# EAGLE design Quadflat-customized (EAGLE 9.0.1)

## Sheet 1 of 2

## Sheet 2 of 2
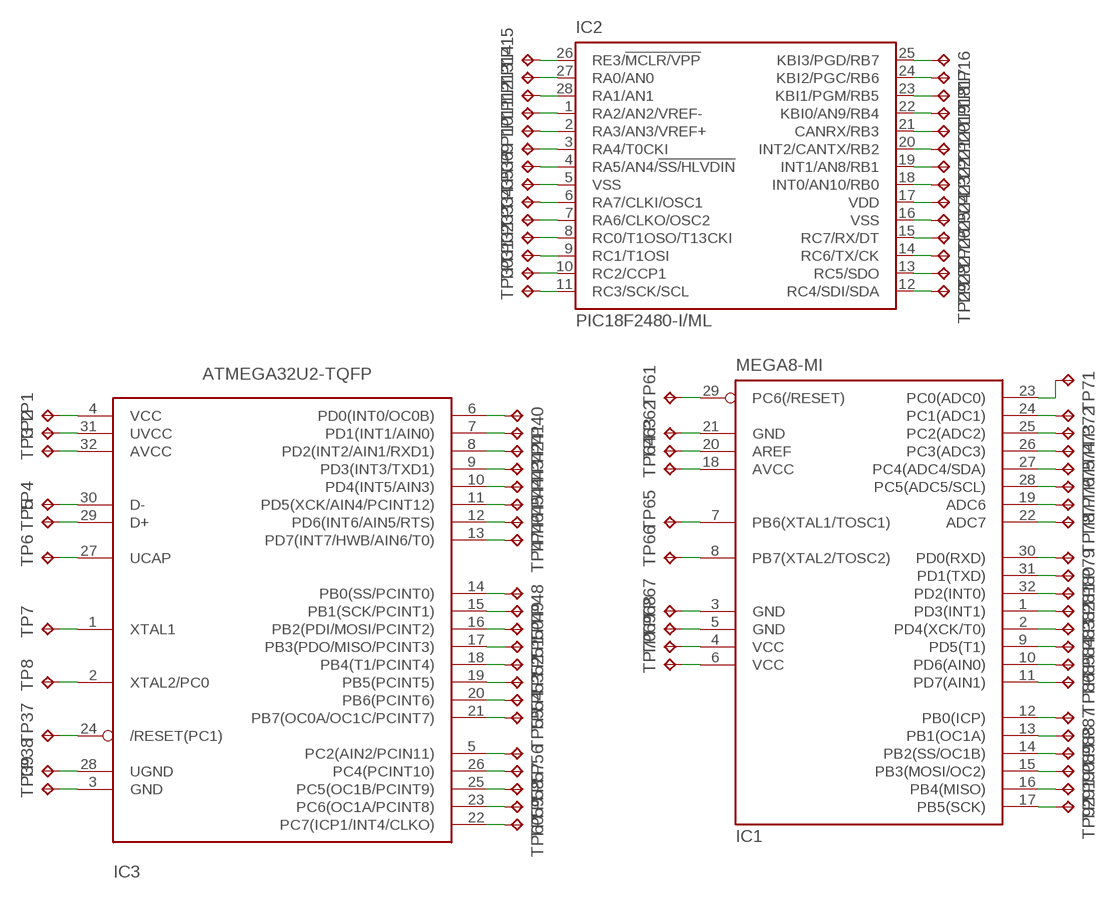
[diagram p0: schematic, sheet 2]

### Parts
IC1  MEGA8-MI  [MLF32]
IC2  PIC18F2480-I/ML  [QFN28-ML_6X6MM]
IC3  ATMEGA32U2-TQFP  [TQFP32-08]
TP1  TPPAD1-13Y  [P1-13Y]
TP2  TPPAD1-13Y  [P1-13Y]
TP3  TPPAD1-13Y  [P1-13Y]
TP4  TPPAD1-13Y  [P1-13Y]
TP5  TPPAD1-13Y  [P1-13Y]
TP6  TPPAD1-13Y  [P1-13Y]
TP7  TPPAD1-13Y  [P1-13Y]
TP8  TPPAD1-13Y  [P1-13Y]
TP9  TPPAD1-13Y  [P1-13Y]
TP10  TPPAD1-13Y  [P1-13Y]
TP11  TPPAD1-13Y  [P1-13Y]
TP12  TPPAD1-13Y  [P1-13Y]
TP13  TPPAD1-13Y  [P1-13Y]
TP14  TPPAD1-13Y  [P1-13Y]
TP15  TPPAD1-13Y  [P1-13Y]
TP16  TPPAD1-13Y  [P1-13Y]
TP17  TPPAD1-13Y  [P1-13Y]
TP18  TPPAD1-13Y  [P1-13Y]
TP19  TPPAD1-13Y  [P1-13Y]
TP20  TPPAD1-13Y  [P1-13Y]
TP21  TPPAD1-13Y  [P1-13Y]
TP22  TPPAD1-13Y  [P1-13Y]
TP23  TPPAD1-13Y  [P1-13Y]
TP24  TPPAD1-13Y  [P1-13Y]
TP25  TPPAD1-13Y  [P1-13Y]
TP26  TPPAD1-13Y  [P1-13Y]
TP27  TPPAD1-13Y  [P1-13Y]
TP28  TPPAD1-13Y  [P1-13Y]
TP29  TPPAD1-13Y  [P1-13Y]
TP30  TPPAD1-13Y  [P1-13Y]
TP31  TPPAD1-13Y  [P1-13Y]
TP32  TPPAD1-13Y  [P1-13Y]
TP33  TPPAD1-13Y  [P1-13Y]
TP34  TPPAD1-13Y  [P1-13Y]
TP35  TPPAD1-13Y  [P1-13Y]
TP36  TPPAD1-13Y  [P1-13Y]
TP37  TPPAD1-13Y  [P1-13Y]
TP38  TPPAD1-13Y  [P1-13Y]
TP39  TPPAD1-13Y  [P1-13Y]
TP40  TPPAD1-13Y  [P1-13Y]
TP41  TPPAD1-13Y  [P1-13Y]
TP42  TPPAD1-13Y  [P1-13Y]
TP43  TPPAD1-13Y  [P1-13Y]
TP44  TPPAD1-13Y  [P1-13Y]
TP45  TPPAD1-13Y  [P1-13Y]
TP46  TPPAD1-13Y  [P1-13Y]
TP47  TPPAD1-13Y  [P1-13Y]
TP48  TPPAD1-13Y  [P1-13Y]
TP49  TPPAD1-13Y  [P1-13Y]
TP50  TPPAD1-13Y  [P1-13Y]
TP51  TPPAD1-13Y  [P1-13Y]
TP52  TPPAD1-13Y  [P1-13Y]
TP53  TPPAD1-13Y  [P1-13Y]
TP54  TPPAD1-13Y  [P1-13Y]
TP55  TPPAD1-13Y  [P1-13Y]
TP56  TPPAD1-13Y  [P1-13Y]
TP57  TPPAD1-13Y  [P1-13Y]
TP58  TPPAD1-13Y  [P1-13Y]
TP59  TPPAD1-13Y  [P1-13Y]
TP60  TPPAD1-13Y  [P1-13Y]
TP61  TPPAD1-13Y  [P1-13Y]
TP62  TPPAD1-13Y  [P1-13Y]
TP63  TPPAD1-13Y  [P1-13Y]
TP64  TPPAD1-13Y  [P1-13Y]
TP65  TPPAD1-13Y  [P1-13Y]
TP66  TPPAD1-13Y  [P1-13Y]
TP67  TPPAD1-13Y  [P1-13Y]
TP68  TPPAD1-13Y  [P1-13Y]
TP69  TPPAD1-13Y  [P1-13Y]
TP70  TPPAD1-13Y  [P1-13Y]
TP71  TPPAD1-13Y  [P1-13Y]
TP72  TPPAD1-13Y  [P1-13Y]
TP73  TPPAD1-13Y  [P1-13Y]
TP74  TPPAD1-13Y  [P1-13Y]
TP75  TPPAD1-13Y  [P1-13Y]
TP76  TPPAD1-13Y  [P1-13Y]
TP77  TPPAD1-13Y  [P1-13Y]
TP78  TPPAD1-13Y  [P1-13Y]
TP79  TPPAD1-13Y  [P1-13Y]
TP80  TPPAD1-13Y  [P1-13Y]
TP81  TPPAD1-13Y  [P1-13Y]
TP82  TPPAD1-13Y  [P1-13Y]
TP83  TPPAD1-13Y  [P1-13Y]
TP84  TPPAD1-13Y  [P1-13Y]
TP85  TPPAD1-13Y  [P1-13Y]
TP86  TPPAD1-13Y  [P1-13Y]
TP87  TPPAD1-13Y  [P1-13Y]
TP88  TPPAD1-13Y  [P1-13Y]
TP89  TPPAD1-13Y  [P1-13Y]
TP90  TPPAD1-13Y  [P1-13Y]
TP91  TPPAD1-13Y  [P1-13Y]
TP92  TPPAD1-13Y  [P1-13Y]

### Nets
N$1: IC3.4(VCC) TP1.TP
N$2: IC3.31(UVCC) TP2.TP
N$3: IC3.32(AVCC) TP3.TP
N$4: IC3.30(D-) TP4.TP
N$5: IC3.29(D+) TP5.TP
N$6: IC3.27(UCAP) TP6.TP
N$7: IC3.1(XTAL1) TP7.TP
N$8: IC3.2(XTAL2/PC0) TP8.TP
N$9: IC2.11(RC3/SCK/SCL) TP30.TP
N$10: IC2.10(RC2/CCP1) TP31.TP
N$11: IC2.9(RC1/T1OSI) TP32.TP
N$12: IC2.8(RC0/T1OSO/T13CKI) TP33.TP
N$13: IC2.7(RA6/CLKO/OSC2) TP34.TP
N$14: IC2.6(RA7/CLKI/OSC1) TP35.TP
N$15: IC2.5(VSS) TP36.TP
N$16: IC2.4(RA5/AN4/!SS/HLVDIN) TP9.TP
N$17: IC2.3(RA4/T0CKI) TP10.TP
N$18: IC2.2(RA3/AN3/VREF+) TP11.TP
N$19: IC2.1(RA2/AN2/VREF-) TP12.TP
N$20: IC2.28(RA1/AN1) TP13.TP
N$21: IC2.27(RA0/AN0) TP14.TP
N$22: IC2.26(RE3/!MCLR/VPP) TP15.TP
N$23: IC2.25(KBI3/PGD/RB7) TP16.TP
N$24: IC2.24(KBI2/PGC/RB6) TP17.TP
N$25: IC2.23(KBI1/PGM/RB5) TP18.TP
N$26: IC2.22(KBI0/AN9/RB4) TP19.TP
N$27: IC2.21(CANRX/RB3) TP20.TP
N$28: IC2.20(INT2/CANTX/RB2) TP21.TP
N$29: IC2.19(INT1/AN8/RB1) TP22.TP
N$30: IC2.18(INT0/AN10/RB0) TP23.TP
N$31: IC2.17(VDD) TP24.TP
N$32: IC2.16(VSS) TP25.TP
N$33: IC2.15(RC7/RX/DT) TP26.TP
N$34: IC2.14(RC6/TX/CK) TP27.TP
N$35: IC2.13(RC5/SDO) TP28.TP
N$36: IC2.12(RC4/SDI/SDA) TP29.TP
N$37: IC3.24(/RESET(PC1)) TP37.TP
N$38: IC3.28(UGND) TP38.TP
N$39: IC3.3(GND) TP39.TP
N$40: IC3.22(PC7(ICP1/INT4/CLKO)) TP60.TP
N$41: IC3.23(PC6(OC1A/PCINT8)) TP59.TP
N$42: IC3.25(PC5(OC1B/PCINT9)) TP58.TP
N$43: IC3.26(PC4(PCINT10)) TP57.TP
N$44: IC3.5(PC2(AIN2/PCIN11)) TP56.TP
N$45: IC3.21(PB7(OC0A/OC1C/PCINT7)) TP55.TP
N$46: IC3.20(PB6(PCINT6)) TP54.TP
N$47: IC3.19(PB5(PCINT5)) TP53.TP
N$48: IC3.18(PB4(T1/PCINT4)) TP52.TP
N$49: IC3.17(PB3(PDO/MISO/PCINT3)) TP51.TP
N$50: IC3.16(PB2(PDI/MOSI/PCINT2)) TP50.TP
N$51: IC3.15(PB1(SCK/PCINT1)) TP49.TP
N$52: IC3.14(PB0(SS/PCINT0)) TP48.TP
N$53: IC3.13(PD7(INT7/HWB/AIN6/T0)) TP47.TP
N$54: IC3.12(PD6(INT6/AIN5/RTS)) TP46.TP
N$55: IC3.11(PD5(XCK/AIN4/PCINT12)) TP45.TP
N$56: IC3.10(PD4(INT5/AIN3)) TP44.TP
N$57: IC3.9(PD3(INT3/TXD1)) TP43.TP
N$58: IC3.8(PD2(INT2/AIN1/RXD1)) TP42.TP
N$59: IC3.7(PD1(INT1/AIN0)) TP41.TP
N$60: IC3.6(PD0(INT0/OC0B)) TP40.TP
N$61: IC1.29(PC6(/RESET)) TP61.TP
N$62: IC1.21(GND) TP62.TP
N$63: IC1.20(AREF) TP63.TP
N$64: IC1.18(AVCC) TP64.TP
N$65: IC1.7(PB6(XTAL1/TOSC1)) TP65.TP
N$66: IC1.8(PB7(XTAL2/TOSC2)) TP66.TP
N$67: IC1.3(GND) TP67.TP
N$68: IC1.5(GND) TP68.TP
N$69: IC1.4(VCC) TP69.TP
N$70: IC1.6(VCC) TP70.TP
N$71: IC1.23(PC0(ADC0)) TP71.TP
N$72: IC1.24(PC1(ADC1)) TP72.TP
N$73: IC1.25(PC2(ADC2)) TP73.TP
N$74: IC1.26(PC3(ADC3)) TP74.TP
N$75: IC1.27(PC4(ADC4/SDA)) TP75.TP
N$76: IC1.28(PC5(ADC5/SCL)) TP76.TP
N$77: IC1.19(ADC6) TP77.TP
N$78: IC1.22(ADC7) TP78.TP
N$79: IC1.30(PD0(RXD)) TP79.TP
N$80: IC1.31(PD1(TXD)) TP80.TP
N$81: IC1.32(PD2(INT0)) TP81.TP
N$82: IC1.1(PD3(INT1)) TP82.TP
N$83: IC1.2(PD4(XCK/T0)) TP83.TP
N$84: IC1.9(PD5(T1)) TP84.TP
N$85: IC1.10(PD6(AIN0)) TP85.TP
N$86: IC1.11(PD7(AIN1)) TP86.TP
N$87: IC1.12(PB0(ICP)) TP87.TP
N$88: IC1.13(PB1(OC1A)) TP88.TP
N$89: IC1.14(PB2(SS/OC1B)) TP89.TP
N$90: IC1.15(PB3(MOSI/OC2)) TP90.TP
N$91: IC1.16(PB4(MISO)) TP91.TP
N$92: IC1.17(PB5(SCK)) TP92.TP

## Library data of the parts
IC1 = atmel:MEGA8: MICROCONTROLLER 8 Kbytes FLASH, 1 kbytes SRAM, 512 bytes EEPROM, USART, 6-channel 10 bit ADC, 2-channel 8 bit ADC Pin compatible with Atmega48, ATMega88, ATMega168 Source: avr.lbr; MPN: ATMEGA88PA-MU; OC_FARNELL: 1715491; OC_NEWARK: 15R0272
IC2 = microchip:PIC18F2*80: 28-Pin Enhanced Flash Microcontrollers with ECAN(TM) Technology 10-Bit A/D and nanoWatt Technology Source: http://www.microchip.com .. 39637a.pdf; MF: MICROCHIP; MPN: PIC18F2480-I/ML; OC_FARNELL: 1556179; OC_NEWARK: 71J7235
IC3 = atmega_ext:ATMEGA32U2: ATmega32u2 Pin compatible with the atmega8u2, atmega16u2 and atmega32u2 8, 16 or 32 K flash, 1K RAM, 512b EEPROM 8 bit and 16 bit timer (5 PWM total) UART, SPI (no I2C!) USB with 4 endpoints, LUFA compatible 22 I/O lines, analog comparator (no ADC!) Comes with DFU bootloader burned in!
TP1-TP92 = testpad:TP: Test pad

## Board
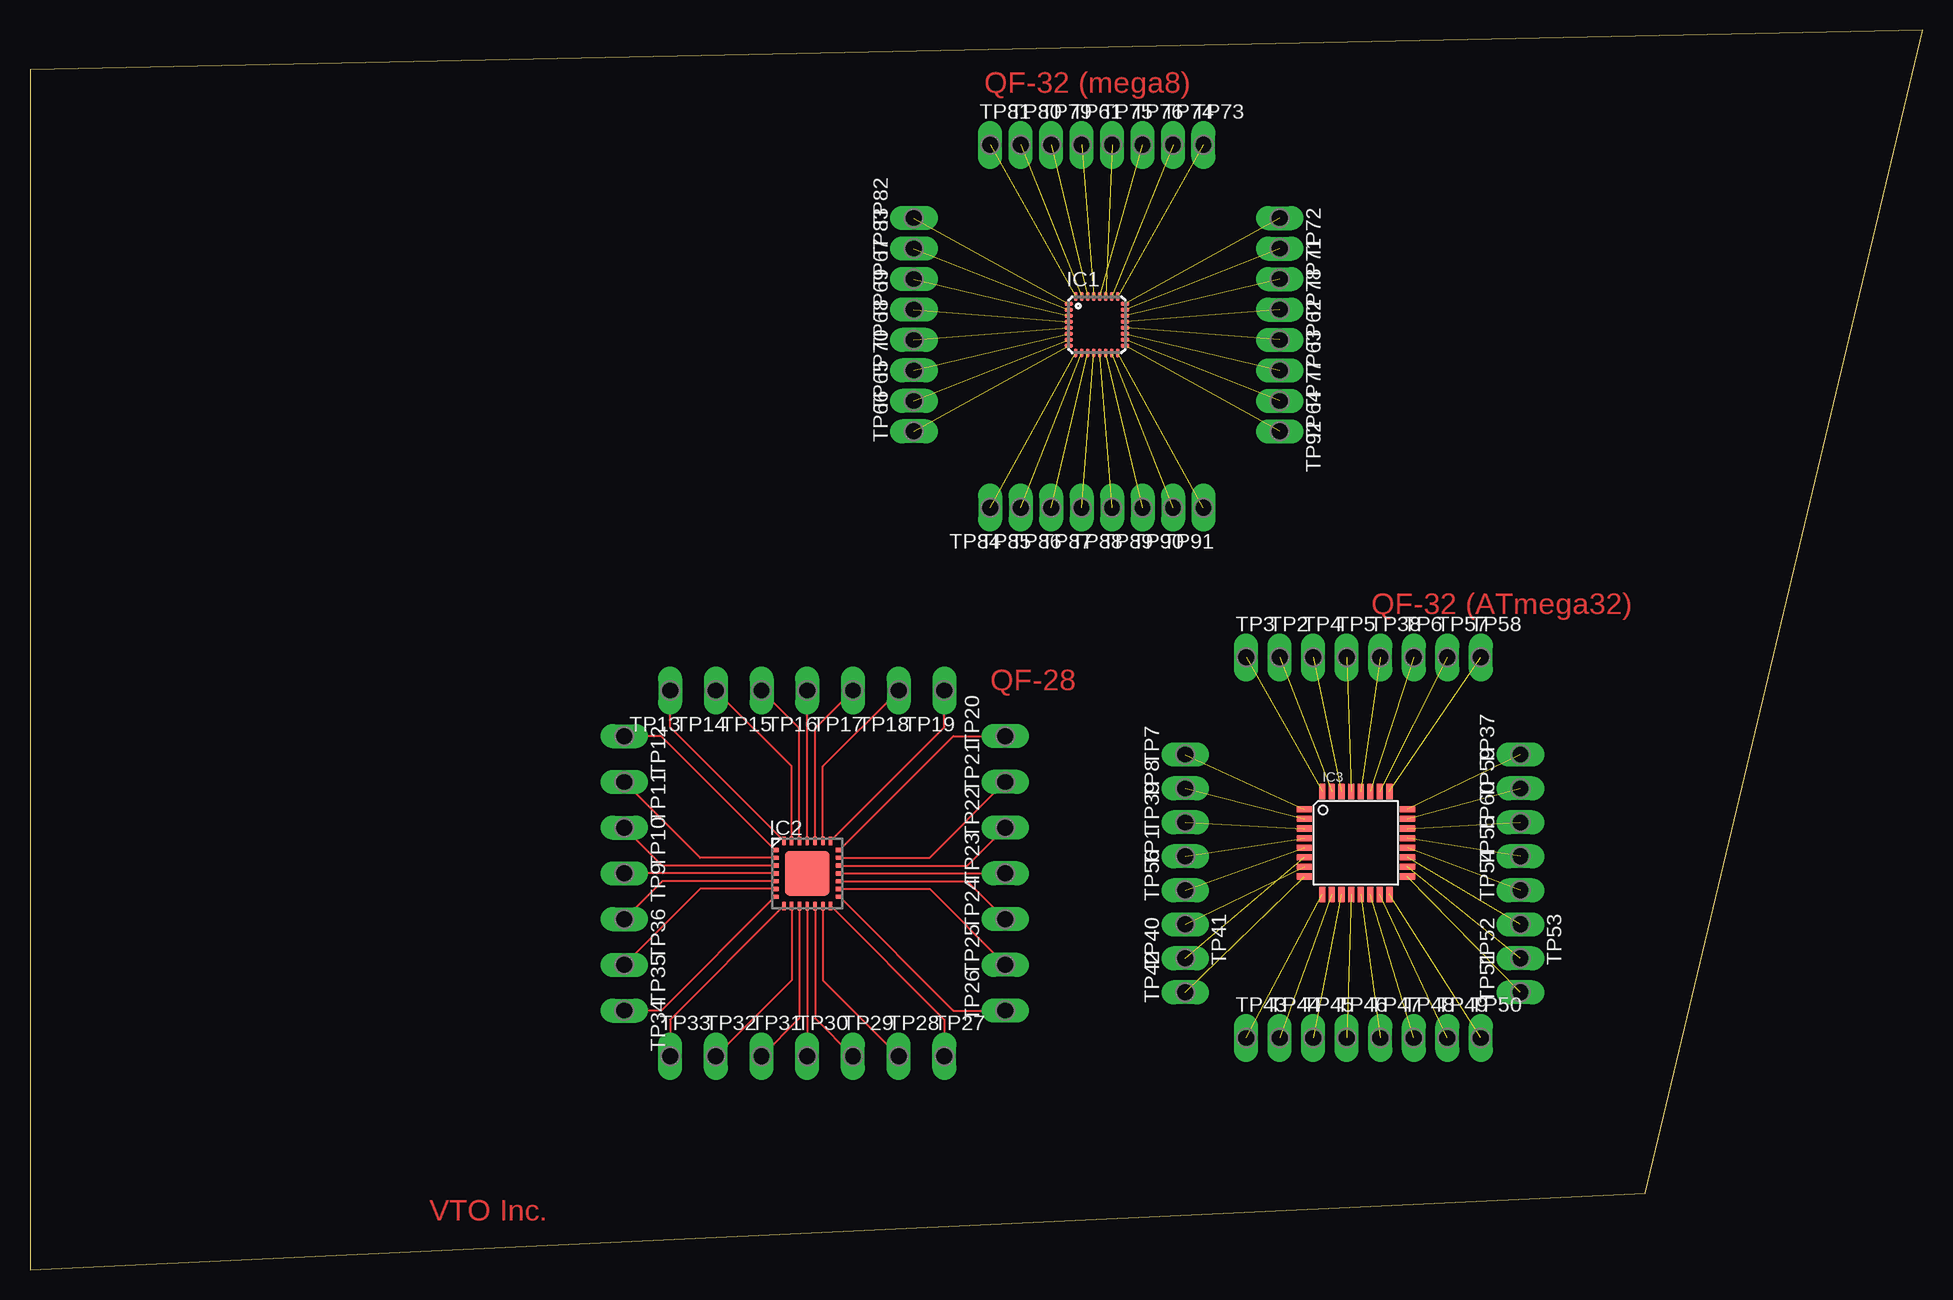
[diagram p1: board, top side]

Size 157.71 x 103.3 mm. Coordinates in mm from the lower left corner, seen from the top.
Outline: 0,0 134.6,6.35 157.71,103.3 0,100 0,0
Copper layers (1*16): Top 0.035mm / dielectric 1.5mm / Bottom 0.035mm
Design rules "default": minimum track width 6mil, minimum drill 0.35mm, track to track 6mil, track to pad 6mil, pad to pad 6mil, via to via 6mil, smd to smd 6mil, copper to edge 40mil, drill to drill 6mil, minimum pad ring 10mil, minimum via ring 8mil, stop-mask expansion 4mil, vias tented up to drill 0mil, thermal gap 10mil

### Footprints (pad centres in the part's own frame; a part is rotated, then mirrored left to right if it is on the bottom)
MLF32 = smd 0.7 x 0.3: 1 -2.35,1.75; 2 -2.35,1.25; 3 -2.35,0.75; 4 -2.35,0.25; 5 -2.35,-0.25; 6 -2.35,-0.75; 7 -2.35,-1.25; 8 -2.35,-1.75; 17 2.35,-1.75; 18 2.35,-1.25; 19 2.35,-0.75; 20 2.35,-0.25; 21 2.35,0.25; 22 2.35,0.75; 23 2.35,1.25; 24 2.35,1.75 | smd 0.3 x 0.7: 9 -1.75,-2.35; 10 -1.25,-2.35; 11 -0.75,-2.35; 12 -0.25,-2.35; 13 0.25,-2.35; 14 0.75,-2.35; 15 1.25,-2.35; 16 1.75,-2.35; 25 1.75,2.35; 26 1.25,2.35; 27 0.75,2.35; 28 0.25,2.35; 29 -0.25,2.35; 30 -0.75,2.35; 31 -1.25,2.35; 32 -1.75,2.35
QFN28-ML_6X6MM = smd 0.7 x 0.35: 1 -2.7,1.95; 2 -2.7,1.3; 3 -2.7,0.65; 4 -2.7,0; 5 -2.7,-0.65; 6 -2.7,-1.3; 7 -2.7,-1.95; 15 2.7,-1.95; 16 2.7,-1.3; 17 2.7,-0.65; 18 2.7,0; 19 2.7,0.65; 20 2.7,1.3; 21 2.7,1.95 | smd 0.35 x 0.7: 8 -1.95,-2.7; 9 -1.3,-2.7; 10 -0.65,-2.7; 11 0,-2.7; 12 0.65,-2.7; 13 1.3,-2.7; 14 1.95,-2.7; 22 1.95,2.7; 23 1.3,2.7; 24 0.65,2.7; 25 0,2.7; 26 -0.65,2.7; 27 -1.3,2.7; 28 -1.95,2.7 | smd 3.7 x 3.7: EXP 0,0
TQFP32-08 = smd 1.27 x 0.508: 1 -4.293,2.8; 2 -4.293,2; 3 -4.293,1.2; 4 -4.293,0.4; 5 -4.293,-0.4; 6 -4.293,-1.2; 7 -4.293,-2; 8 -4.293,-2.8; 17 4.293,-2.8; 18 4.293,-2; 19 4.293,-1.2; 20 4.293,-0.4; 21 4.293,0.4; 22 4.293,1.2; 23 4.293,2; 24 4.293,2.8 | smd 0.508 x 1.27: 9 -2.8,-4.293; 10 -2,-4.293; 11 -1.2,-4.293; 12 -0.4,-4.293; 13 0.4,-4.293; 14 1.2,-4.293; 15 2,-4.293; 16 2.8,-4.293; 25 2.8,4.293; 26 2,4.293; 27 1.2,4.293; 28 0.4,4.293; 29 -0.4,4.293; 30 -1.2,4.293; 31 -2,4.293; 32 -2.8,4.293
P1-13Y = drill 1.321 pad 1.905 long: TP 0,0

### Placement (x,y rotation side)
IC1  88.9,78.74 0 top
IC2  64.77,33.02 0 top
IC3  110.49,35.56 0 top
TP1  96.27,34.44 90 top
TP2  104.14,51.02 0 top
TP3  101.35,51.02 0 top
TP4  106.93,51.02 0 top
TP5  109.73,51.02 0 top
TP6  115.32,51.02 0 top
TP7  96.27,42.93 90 top
TP8  96.27,40.1 90 top
TP9  49.53,33.02 270 top
TP10  49.53,36.83 270 top
TP11  49.53,40.64 270 top
TP12  49.53,44.45 270 top
TP13  53.34,48.26 180 top
TP14  57.15,48.26 180 top
TP15  60.96,48.26 180 top
TP16  64.77,48.26 180 top
TP17  68.58,48.26 180 top
TP18  72.39,48.26 180 top
TP19  76.2,48.26 180 top
TP20  81.28,44.45 90 top
TP21  81.28,40.64 90 top
TP22  81.28,36.83 90 top
TP23  81.28,33.02 90 top
TP24  81.28,29.21 90 top
TP25  81.28,25.4 90 top
TP26  81.28,21.59 90 top
TP27  76.2,17.78 0 top
TP28  72.39,17.78 0 top
TP29  68.58,17.78 0 top
TP30  64.77,17.78 0 top
TP31  60.96,17.78 0 top
TP32  57.15,17.78 0 top
TP33  53.34,17.78 0 top
TP34  49.53,21.59 270 top
TP35  49.53,25.4 270 top
TP36  49.53,29.21 270 top
TP37  124.21,42.93 90 top
TP38  112.52,51.02 0 top
TP39  96.27,37.27 90 top
TP40  96.27,25.94 90 top
TP41  96.27,28.77 270 top
TP42  96.27,23.11 90 top
TP43  101.35,19.3 0 top
TP44  104.14,19.3 0 top
TP45  106.93,19.3 0 top
TP46  109.73,19.3 0 top
TP47  112.52,19.3 0 top
TP48  115.32,19.3 0 top
TP49  118.11,19.3 0 top
TP50  120.9,19.3 0 top
TP51  124.21,23.11 90 top
TP52  124.21,25.94 90 top
TP53  124.21,28.77 270 top
TP54  124.21,31.6 90 top
TP55  124.21,34.44 90 top
TP56  96.27,31.6 90 top
TP57  118.11,51.02 0 top
TP58  120.9,51.02 0 top
TP59  124.21,40.1 90 top
TP60  124.21,37.27 90 top
TP61  87.63,93.73 0 top
TP62  104.14,80.01 270 top
TP63  104.14,77.47 270 top
TP64  104.14,72.39 270 top
TP65  73.66,72.39 90 top
TP66  73.66,69.85 90 top
TP67  73.66,82.55 90 top
TP68  73.66,77.47 90 top
TP69  73.66,80.01 90 top
TP70  73.66,74.93 90 top
TP71  104.14,85.09 270 top
TP72  104.14,87.63 270 top
TP73  97.79,93.73 0 top
TP74  95.25,93.73 0 top
TP75  90.17,93.73 0 top
TP76  92.71,93.73 0 top
TP77  104.14,74.93 270 top
TP78  104.14,82.55 270 top
TP79  85.09,93.73 0 top
TP80  82.55,93.73 0 top
TP81  80.01,93.73 0 top
TP82  73.66,87.63 90 top
TP83  73.66,85.09 90 top
TP84  80.01,63.5 180 top
TP85  82.55,63.5 180 top
TP86  85.09,63.5 180 top
TP87  87.63,63.5 180 top
TP88  90.17,63.5 180 top
TP89  92.71,63.5 180 top
TP90  95.25,63.5 180 top
TP91  97.79,63.5 180 top
TP92  104.14,69.85 270 top

### Tracks (layer width: path | path; a pad name or v marks a point on that pad's centre or on a via)
N$1  (1 unrouted)
N$2  (1 unrouted)
N$3  (1 unrouted)
N$4  (1 unrouted)
N$5  (1 unrouted)
N$6  (1 unrouted)
N$7  (1 unrouted)
N$8  (1 unrouted)
N$9
  Top 0.152: IC2.11 TP30.TP
N$10
  Top 0.152: IC2.10 64.12,20.94 TP31.TP
N$11
  Top 0.152: IC2.9 63.47,24.1 TP32.TP
N$12
  Top 0.152: IC2.8 53.34,20.84 TP33.TP
N$13
  Top 0.152: IC2.7 52.59,21.59 TP34.TP
N$14
  Top 0.152: IC2.6 55.85,31.72 TP35.TP
N$15
  Top 0.152: IC2.5 52.69,32.37 TP36.TP
N$16
  Top 0.152: IC2.4 TP9.TP
N$17
  Top 0.152: IC2.3 52.69,33.67 TP10.TP
N$18
  Top 0.152: IC2.2 55.85,34.32 TP11.TP
N$19
  Top 0.152: IC2.1 52.59,44.45 TP12.TP
N$20
  Top 0.152: IC2.28 53.34,45.2 TP13.TP
N$21
  Top 0.152: IC2.27 63.47,41.94 TP14.TP
N$22
  Top 0.152: IC2.26 64.12,45.1 TP15.TP
N$23
  Top 0.152: IC2.25 TP16.TP
N$24
  Top 0.152: IC2.24 65.42,45.1 TP17.TP
N$25
  Top 0.152: IC2.23 66.07,41.94 TP18.TP
N$26
  Top 0.152: IC2.22 76.2,45.2 TP19.TP
N$27
  Top 0.152: IC2.21 76.95,44.45 TP20.TP
N$28
  Top 0.152: IC2.20 74.96,34.32 TP21.TP
N$29
  Top 0.152: IC2.19 78.12,33.67 TP22.TP
N$30
  Top 0.152: IC2.18 TP23.TP
N$31
  Top 0.152: IC2.17 78.12,32.37 TP24.TP
N$32
  Top 0.152: IC2.16 74.96,31.72 TP25.TP
N$33
  Top 0.152: IC2.15 76.95,21.59 TP26.TP
N$34
  Top 0.152: IC2.14 76.2,20.84 TP27.TP
N$35
  Top 0.152: IC2.13 66.07,24.1 TP28.TP
N$36
  Top 0.152: IC2.12 65.42,20.94 TP29.TP
N$37  (1 unrouted)
N$38  (1 unrouted)
N$39  (1 unrouted)
N$40  (1 unrouted)
N$41  (1 unrouted)
N$42  (1 unrouted)
N$43  (1 unrouted)
N$44  (1 unrouted)
N$45  (1 unrouted)
N$46  (1 unrouted)
N$47  (1 unrouted)
N$48  (1 unrouted)
N$49  (1 unrouted)
N$50  (1 unrouted)
N$51  (1 unrouted)
N$52  (1 unrouted)
N$53  (1 unrouted)
N$54  (1 unrouted)
N$55  (1 unrouted)
N$56  (1 unrouted)
N$57  (1 unrouted)
N$58  (1 unrouted)
N$59  (1 unrouted)
N$60  (1 unrouted)
N$61  (1 unrouted)
N$62  (1 unrouted)
N$63  (1 unrouted)
N$64  (1 unrouted)
N$65  (1 unrouted)
N$66  (1 unrouted)
N$67  (1 unrouted)
N$68  (1 unrouted)
N$69  (1 unrouted)
N$70  (1 unrouted)
N$71  (1 unrouted)
N$72  (1 unrouted)
N$73  (1 unrouted)
N$74  (1 unrouted)
N$75  (1 unrouted)
N$76  (1 unrouted)
N$77  (1 unrouted)
N$78  (1 unrouted)
N$79  (1 unrouted)
N$80  (1 unrouted)
N$81  (1 unrouted)
N$82  (1 unrouted)
N$83  (1 unrouted)
N$84  (1 unrouted)
N$85  (1 unrouted)
N$86  (1 unrouted)
N$87  (1 unrouted)
N$88  (1 unrouted)
N$89  (1 unrouted)
N$90  (1 unrouted)
N$91  (1 unrouted)
N$92  (1 unrouted)

### Text on the board
Top: QF-32 (mega8) | QF-32 (ATmega32) | QF-28 | VTO Inc.